# EAGLE schematic BinaryKeyboard (EAGLE 8.0.0)
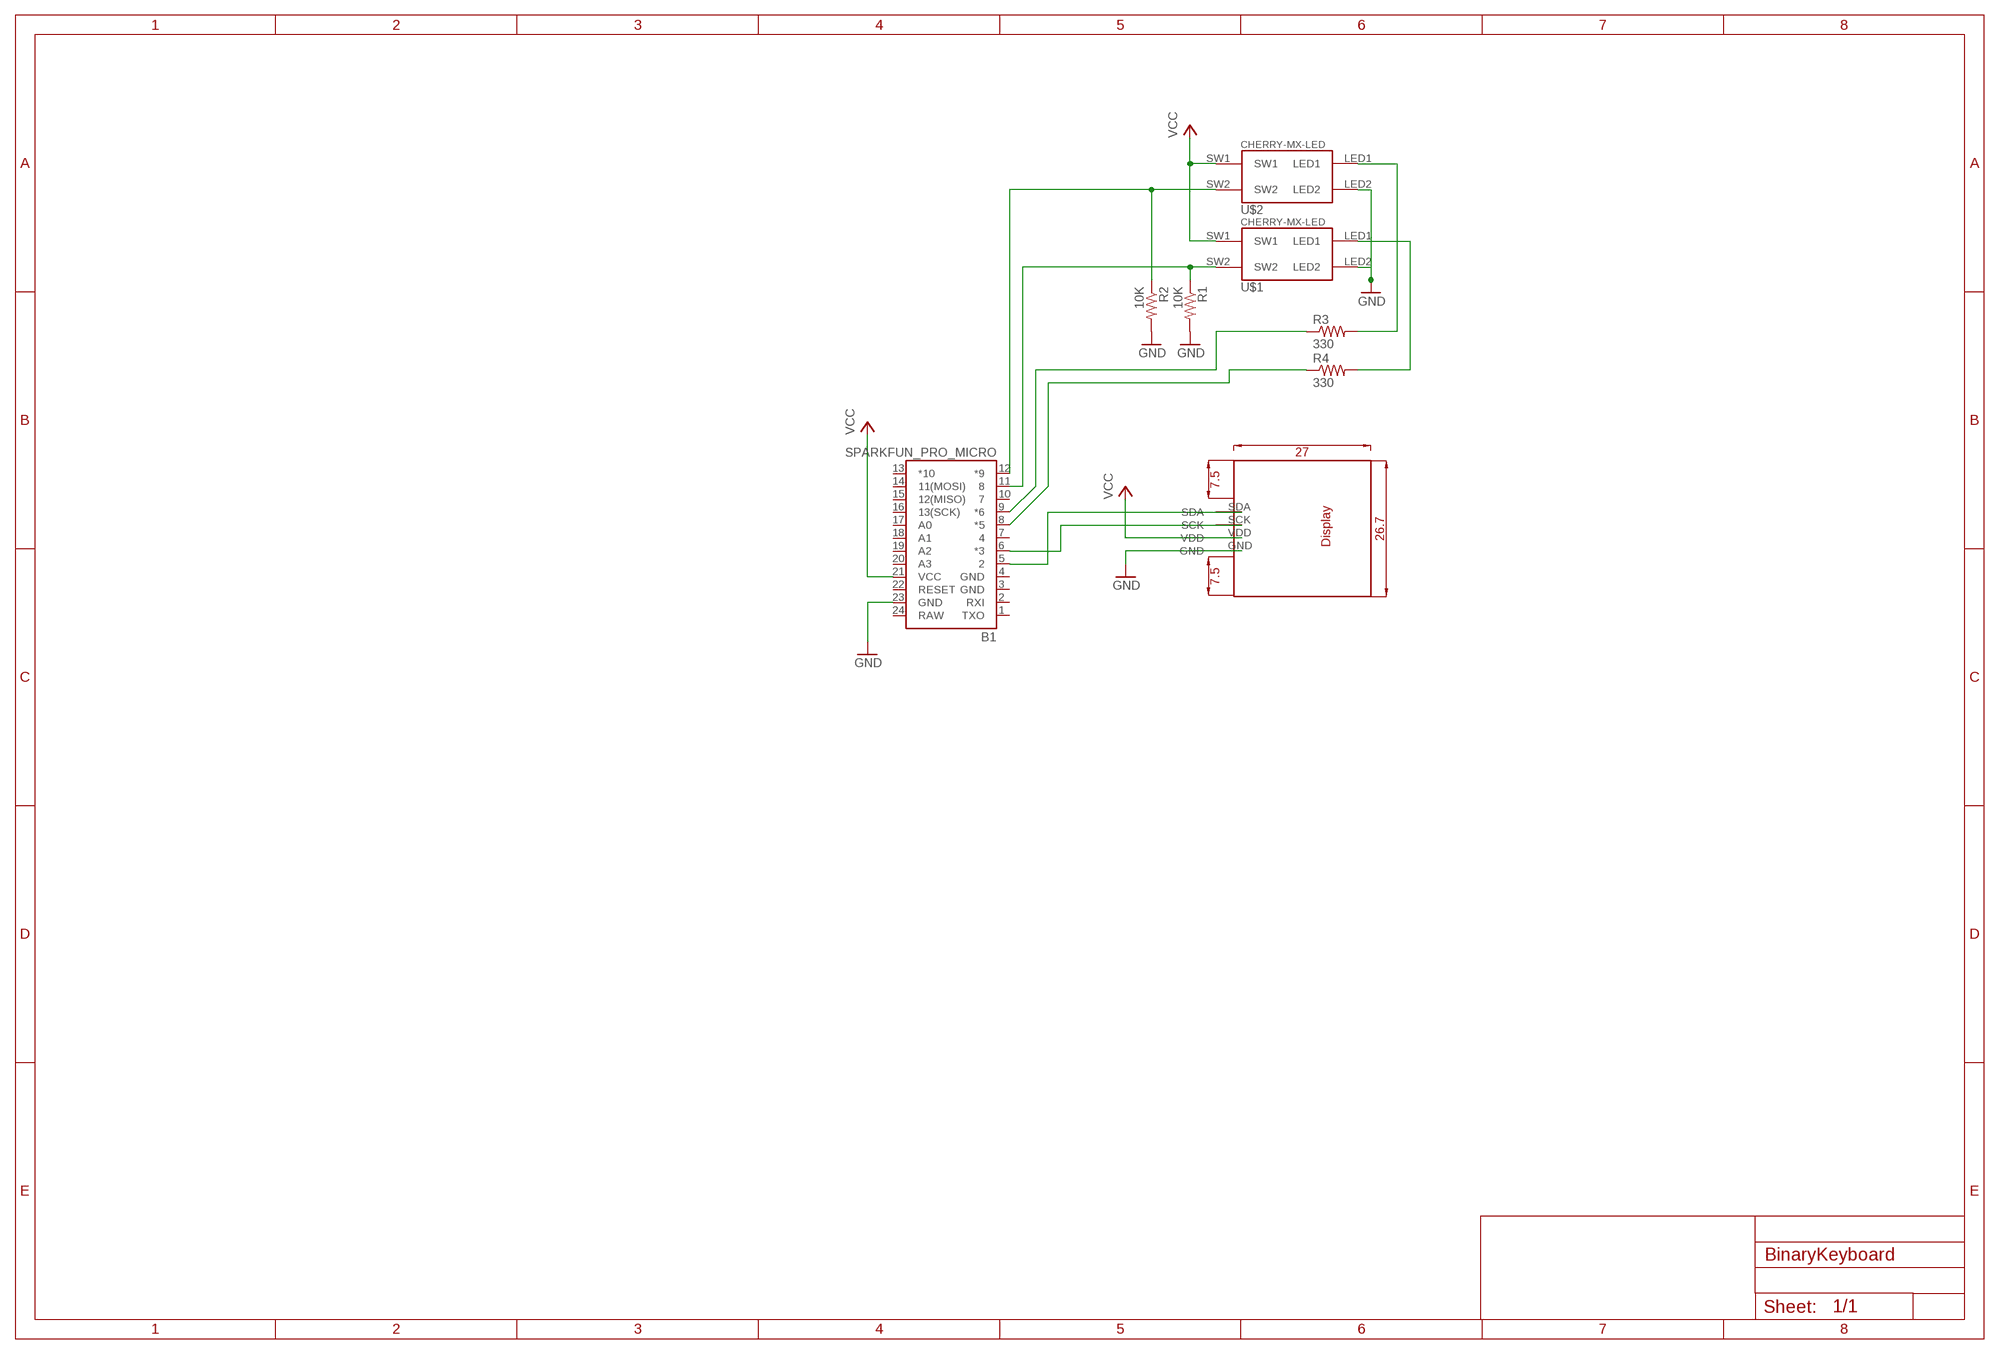
[diagram p0: schematic, sheet 1]

## Parts
B1  SPARKFUN_PRO_MICRO  [SPARKFUN_PRO_MICRO]
DISPLAY1  GM009605  [GM009605]
R1  10K  R-US_0204/7  [0204/7]
R2  10K  R-US_0204/7  [0204/7]
R3  330  R-US_0204/7  [0204/7]
R4  330  R-US_0204/7  [0204/7]
U$1  CHERRY-MX-LED  [CHERRY-MX-LED]
U$2  CHERRY-MX-LED  [CHERRY-MX-LED]

## Nets
GND: B1.23(GND) DISPLAY1.GND R1.2 R2.2 U$1.LED2 U$2.LED2
N$1: B1.11 R1.1 U$1.SW2
N$2: B1.12(*9) R2.1 U$2.SW2
N$3: B1.5 DISPLAY1.SDA
N$4: B1.6(*3) DISPLAY1.SCK
N$5: R3.2 U$2.LED1
N$6: R4.2 U$1.LED1
N$7: B1.9(*6) R3.1
N$8: B1.8(*5) R4.1
VCC: B1.21(VCC) DISPLAY1.VDD U$1.SW1 U$2.SW1
Unconnected: B1.1(TXO) B1.2(RXI) B1.7 B1.10 B1.13(*10) B1.14(11(MOSI)) B1.15(12(MISO)) B1.16(13(SCK)) B1.17(A0) B1.18(A1) B1.19(A2) B1.20(A3) B1.22(RESET)

## Power pins joined to a net without a drawn wire
GND: B1.3(GND) B1.4(GND)
RAW: B1.24(RAW)

## Library data of the parts
B1 = SparkFun-Boards:SPARKFUN_PRO_MICRO: SparkFun Pro Micro Atmega32U4 compatible footprint. SparkFun Products: 3.3V/8MHz <https://www.sparkfun.com/products/12587> 5V/16MHz <https://www.sparkfun.com/products/12640>
DISPLAY1 = CSJ Library:GM009605: GM009605 OLED Display
R1-R4 = resistor:R-US_: RESISTOR, American symbol
U$1 U$2 = cherrymx:CHERRY-MX-LED: Cherry MX series keyswitch with LED